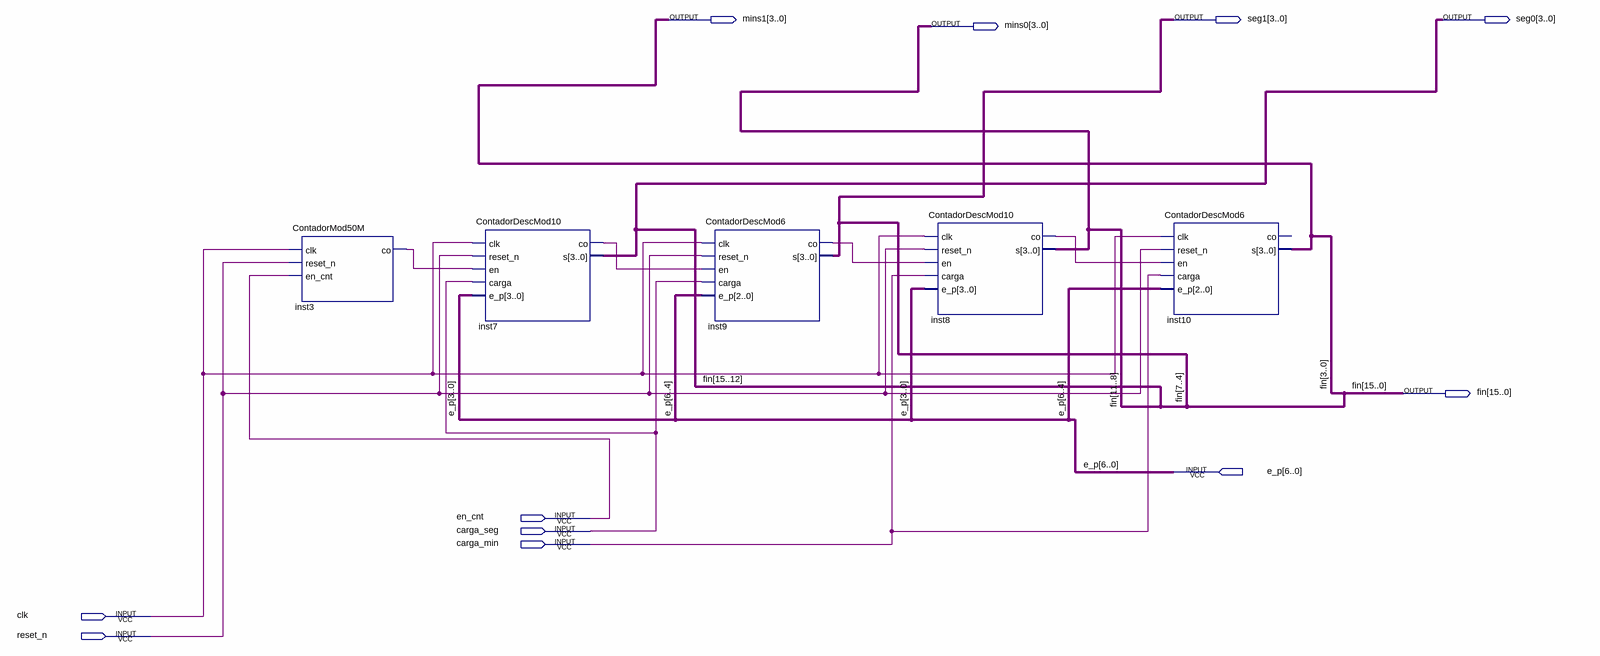
[diagram p0: schematic sheet]
// Quartus schematic temporizador.bdf as structural Verilog: 5 symbols, 11 pins
module temporizador (
  input  [6:0] e_p,
  input  en_cnt,
  input  carga_seg,
  input  carga_min,
  input  clk,
  input  reset_n,
  output [3:0] mins1,
  output [3:0] seg1,
  output [3:0] seg0,
  output [3:0] mins0,
  output [15:0] fin
);

  wire inst3_co, inst7_co, inst8_co, inst9_co;

  ContadorMod50M inst3 (.clk(clk), .reset_n(reset_n), .en_cnt(en_cnt), .co(inst3_co));
  ContadorDescMod10 inst7 (
    .clk(clk), .reset_n(reset_n), .en(inst3_co), .carga(carga_seg), .e_p(e_p[3:0]), .co(inst7_co),
    .s(fin[15:12]));
  ContadorDescMod6 inst9 (
    .clk(clk), .reset_n(reset_n), .en(inst7_co), .carga(carga_seg), .e_p(e_p[6:4]), .co(inst9_co),
    .s(fin[7:4]));
  ContadorDescMod10 inst8 (
    .clk(clk), .reset_n(reset_n), .en(inst9_co), .carga(carga_min), .e_p(e_p[3:0]), .co(inst8_co),
    .s(fin[11:8]));
  ContadorDescMod6 inst10 (
    .clk(clk), .reset_n(reset_n), .en(inst8_co), .carga(carga_min), .e_p(e_p[6:4]), .s(fin[3:0]));  // open: co

  assign mins0 = fin[11:8];
  assign mins1 = fin[3:0];
  assign seg0 = fin[15:12];
  assign seg1 = fin[7:4];
endmodule
